# Altium schematic sheet Draft.SchDoc
size A3
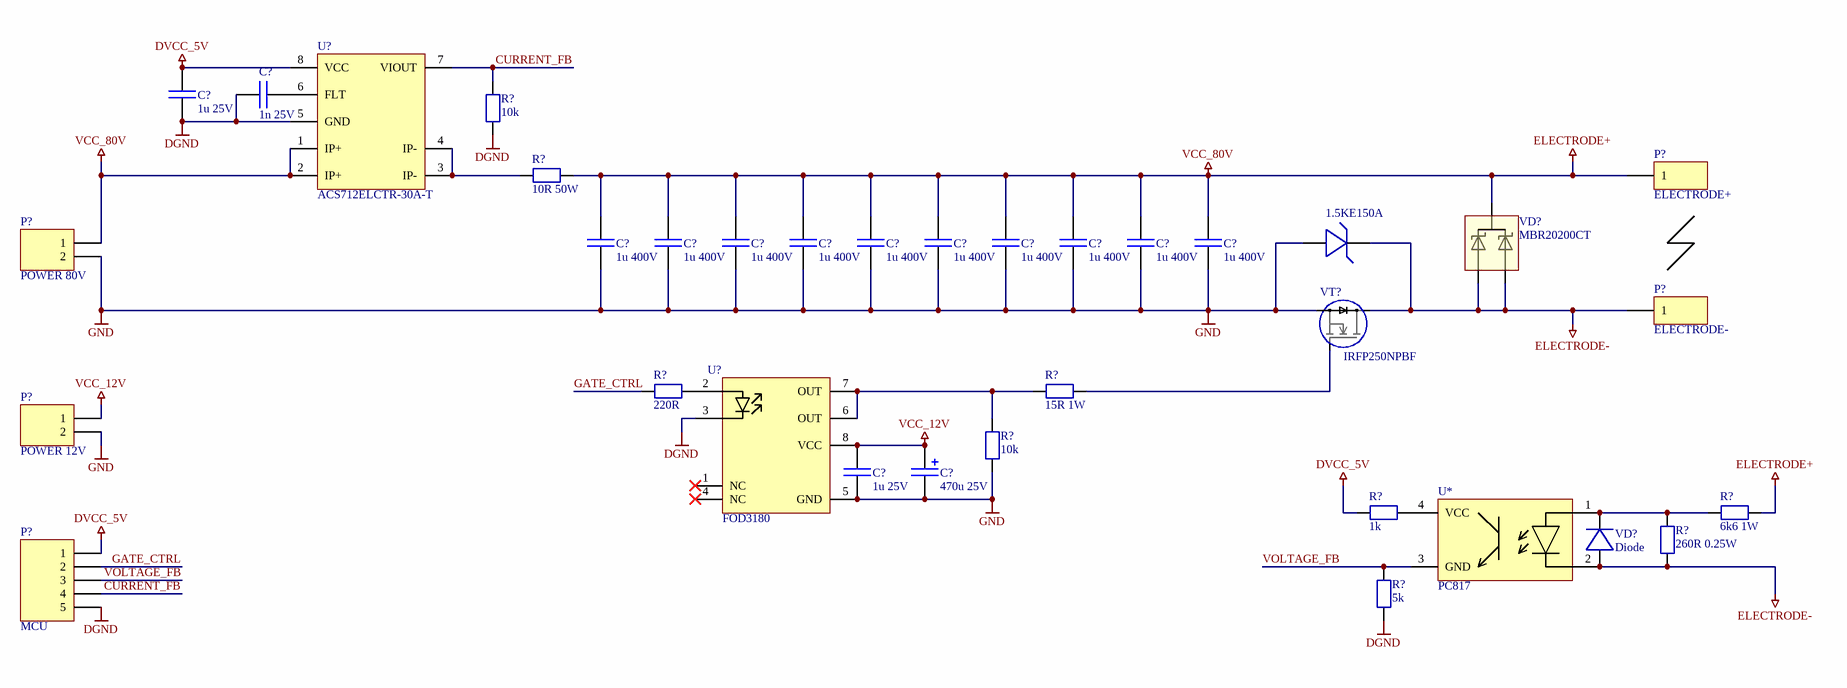
[diagram p0: Draft.SchDoc]

## Parts
(Parts that share a designator on the sheet are numbered #1, #2 ... from top to bottom, then left to right.)
1.5KE150A  (no value)  [SOT23-3]
C?#1  1u 25V  [C_0603/1608]
C?#2  1n 25V  [C_0603/1608]
C?#3  1u 400V  [C_0603/1608]
C?#4  1u 400V  [C_0603/1608]
C?#5  1u 400V  [C_0603/1608]
C?#6  1u 400V  [C_0603/1608]
C?#7  1u 400V  [C_0603/1608]
C?#8  1u 400V  [C_0603/1608]
C?#9  1u 400V  [C_0603/1608]
C?#10  1u 400V  [C_0603/1608]
C?#11  1u 400V  [C_0603/1608]
C?#12  1u 400V  [C_0603/1608]
C?#13  1u 25V  [C_0603/1608]
C?#14  470u 25V  [C_ELECTROLYTIC_6x35]
P?#1  ELECTRODE+  [WIRE_SMD_5X5]
P?#2  POWER 80V  [PLS-2 2.54 OUTLINE]
P?#3  ELECTRODE-  [WIRE_SMD_5X5]
P?#4  POWER 12V  [PLS-2 2.54 OUTLINE]
P?#5  MCU  [HDR_SMD_1x5_1.50]
R?#1  10k  [R_0603/1608]
R?#2  10R 50W  [R_0603/1608]
R?#3  220R  [R_0603/1608]
R?#4  15R 1W  [R_0603/1608]
R?#5  10k  [R_0603/1608]
R?#6  1k  [R_0603/1608]
R?#7  6k6 1W  [R_0603/1608]
R?#8  260R 0.25W  [R_0603/1608]
R?#9  5k  [R_0603/1608]
U*  PC817  [SMD-4]
U?#1  ACS712ELCTR-30A-T  [SO8_1.27]
U?#2  FOD3180  [PDIP-8]
VD?#1  MBR20200CT  [TO-220]
VD?#2  Diode  [DO214AA/SMB]
VT?  IRFP250NPBF  [SOT23-3]

## Nets
DGND: C?#1.2 C?#2.1 P?#5.5 R?#1.1 R?#9.1 U?#1.5(GND) U?#2.3
DVCC_5V: C?#1.1 P?#5.1 R?#6.1 U?#1.8(VCC)
ELECTRODE+: C?#3.1 C?#4.1 C?#5.1 C?#6.1 C?#7.1 C?#8.1 C?#9.1 C?#10.1 C?#11.1 C?#12.1 P?#1.1 P?#2.1 R?#2.1 R?#7.2 U?#1.1(IP+) U?#1.2(IP+) VD?#1.C  [also labelled VCC_80V]
ELECTRODE-: 1.5KE150A.2 P?#3.1 R?#8.1 U*.2 VD?#1.1A VD?#1.2A VD?#2.1 VT?.D
GND: 1.5KE150A.1 C?#3.2 C?#4.2 C?#5.2 C?#6.2 C?#7.2 C?#8.2 C?#9.2 C?#10.2 C?#11.2 C?#12.2 C?#13.2 C?#14.2(NEG) P?#2.2 P?#4.2 R?#5.1 U?#2.5(GND) VT?.S
VCC_12V: C?#13.1 C?#14.1(POS) P?#4.1 U?#2.8(VCC)
CURRENT_FB: P?#5.4 R?#1.2 U?#1.7(VIOUT)
GATE_CTRL: P?#5.2 R?#3.1
VOLTAGE_FB: P?#5.3 R?#9.2 U*.3(GND)
NetC?#2_2: C?#2.2 U?#1.6(FLT)
NetR?#2_2: R?#2.2 U?#1.3(IP-) U?#1.4(IP-)
NetR?#3_2: R?#3.2 U?#2.2
NetR?#4_1: R?#4.1 R?#5.2 U?#2.6(OUT) U?#2.7(OUT)
NetR?#4_2: R?#4.2 VT?.G
NetR?#6_2: R?#6.2 U*.4(VCC)
NetR?#7_1: R?#7.1 R?#8.2 U*.1 VD?#2.2

Not connected (* = marked no-connect by the designer): U?#1 0(EP); U?#2 1(NC)* 4(NC)*

## Library data of the parts
1.5KE150A = TVS: pin to pad: 2>3
C?#1-C?#13 = Capacitor: Non-polarized capacitor
C?#14 = Capacitor polar: Polarized capacitor
P?#1 P?#3 = Header 1: Header, 1-Pin; LatestRevisionDate: 17-Jul-2002; LatestRevisionNote: Re-released for DXP Platform.; Publisher: Altium Limited
P?#2 P?#4 = Header 2: Header, 2-Pin; LatestRevisionDate: 17-Jul-2002; LatestRevisionNote: Re-released for DXP Platform.; Publisher: Altium Limited
P?#5 = Header 5: Header, 5-Pin; LatestRevisionDate: 17-Jul-2002; LatestRevisionNote: Re-released for DXP Platform.; Publisher: Altium Limited
R?#1-R?#9 = Resistor
U* = Optoisolator1
U?#1 = ACS712ELCTR-30A-T: Current sensor
U?#2 = FOD3180: MOSFET driver
VD?#1 = Schottky x2 C-COM
VT? = MOSFET N: pin to pad: D>3 G>1 S>2